# Altium schematic sheet AnalogueIsolatedReceiver.SchDoc
size A4; Author: Pablo R Nava; DrawnBy: Pablo R Nava; Engineer: Pablo R Nava
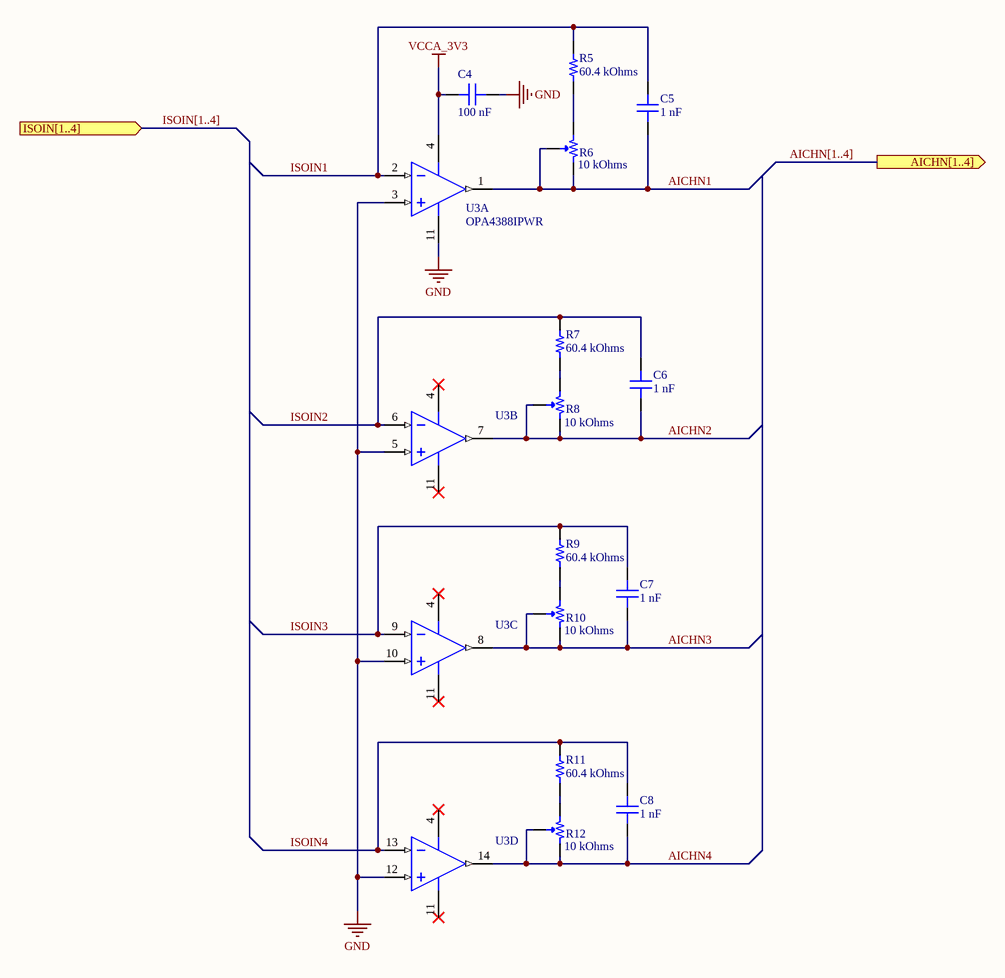
[diagram p0: AnalogueIsolatedReceiver.SchDoc]

## Parts
C4  100 nF  [CAP 0603_1608]
C5  1 nF  [CAP 0603_1608]
C6  1 nF  [CAP 0603_1608]
C7  1 nF  [CAP 0603_1608]
C8  1 nF  [CAP 0603_1608]
R5  60.4 kOhms  [RES 0603_1608]
R6  10 kOhms  [POT BOURNS TRIMPOT 3224W]
R7  60.4 kOhms  [RES 0603_1608]
R8  10 kOhms  [POT BOURNS TRIMPOT 3224W]
R9  60.4 kOhms  [RES 0603_1608]
R10  10 kOhms  [POT BOURNS TRIMPOT 3224W]
R11  60.4 kOhms  [RES 0603_1608]
R12  10 kOhms  [POT BOURNS TRIMPOT 3224W]
U3  OPA4388IPWR  [TI TSSOP-14 PW]  (parts A,B,C,D of 4)

## Ports
AICHN[1..4] (out), ISOIN[1..4] (in)

## Nets
GND: C4.1 U3.3(IN1+) U3.5(IN2+) U3.10(IN3+) U3.11(GND) U3.12(IN4+)
VCCA_3V3: C4.2 U3.4(VDD)
AICHN1: C5.2 R6.2 R6.3 U3.1(OUT1)
AICHN2: C6.2 R8.2 R8.3 U3.7(OUT2)
AICHN3: C7.2 R10.2 R10.3 U3.8(OUT3)
AICHN4: C8.2 R12.2 R12.3 U3.14(OUT4)
ISOIN1: C5.1 R5.2 U3.2(IN1-)
ISOIN2: C6.1 R7.2 U3.6(IN2-)
ISOIN3: C7.1 R9.2 U3.9(IN3-)
ISOIN4: C8.1 R11.2 U3.13(IN4-)
NetR5_1: R5.1 R6.1
NetR7_1: R7.1 R8.1
NetR9_1: R9.1 R10.1
NetR11_1: R11.1 R12.1

## Buses and harness runs
bus AICHN[1..4] = port AICHN[1..4]
bus ISOIN[1..4] = port ISOIN[1..4]

## Notes on the sheet
- Title:
- Drawn By:
- Page Contents:
- Checked By:
- Size:
- Date:
- File:
- License:
- Email:
- A4
- Number:
- Time:
- Revision:
- Sheet
- Website:
- of

## Library data of the parts
C4 = 0603YC104KAT2A: MLCC Ceramic 100 nF 16 V 10% Capacitor; Manufacturer: AVX; Voltage: 16 V; Type: capacitor_ceramic; Through Hole: 0; Part Number: 0603YC104KAT2A; Value: 100 nF; Tolerance: 10%; Composition: X7R; Created On: 22/07/2020 19:09:12; Updated On: 22/07/2020 19:10:15; Package: 0603 (1608 Metric)
C5-C8 = 0603ZA102JAT4A: MLCC Ceramic 1 nF 10 V 5% Capacitor; Manufacturer: AVX; Voltage: 10 V; Type: capacitor_ceramic; Through Hole: 0; Part Number: 0603ZA102JAT4A; Value: 1 nF; Tolerance: 5%; Composition: NP0; Created On: 04/08/2020 17:52:12; Updated On: 04/08/2020 17:52:29; Package: 0603 (1608 Metric)
R5 R7 R9 R11 =  CRCW060360K4FKEA: Thin Film Resistor 60.4 kOhms 1%; Manufacturer: Vishay / Dale; Power Max: 100 mW; Through Hole: 0; Part Number: CRCW060360K4FKEA; Value: 60.4 kOhms; Tolerance: 1%; Created On: 17/09/2020 21:59:57; Updated On: 17/09/2020 22:00:30; Type: resistor; Package: 0603 (1608 Metric)
R6 R8 R10 R12 = 3224W-1-103G: Inline Multitourn 10 kOhms 10% potentiometer; Manufacturer: Bourns; Maximum Power: 250 mW; Minimum Resistance: 0 Ohms; Number of Turns: 12; Through Hole: 0; Part Number: 3224W-1-103G; Value: 10 kOhms; Tolerance: 10%; Maximum Resistance: 10 kOhms; Created On: 04/08/2020 17:43:15; Updated On: 04/08/2020 17:43:43; Type: potentiometer; Package: 3224W
U3 = OPA4388IPWR: OPA4388 Zero-Drift, Zero-Crossover, Low Offset, Precision Rail-to-Rail I/O Opamp; Manufacturer: Texas Instruments; Gain Bandwith Product: 10 MHz; Slew Rate: 5 V/us; Voltage Supplies: ±1.25 V to ±2.75 V; Input Offset Voltage: 0.25 uV; Output Current: ±30 mA; Through Hole: 0; Part Number: OPA4388IPWR; Output Type: Rail-to-Rail; Input Type: Rail-to-Rail; Amplifier Type: precision; Created On: 19/08/2020 23:51:30; Updated On: 19/08/2020 23:56:10; Type: opamp; Package: TSSOP-14